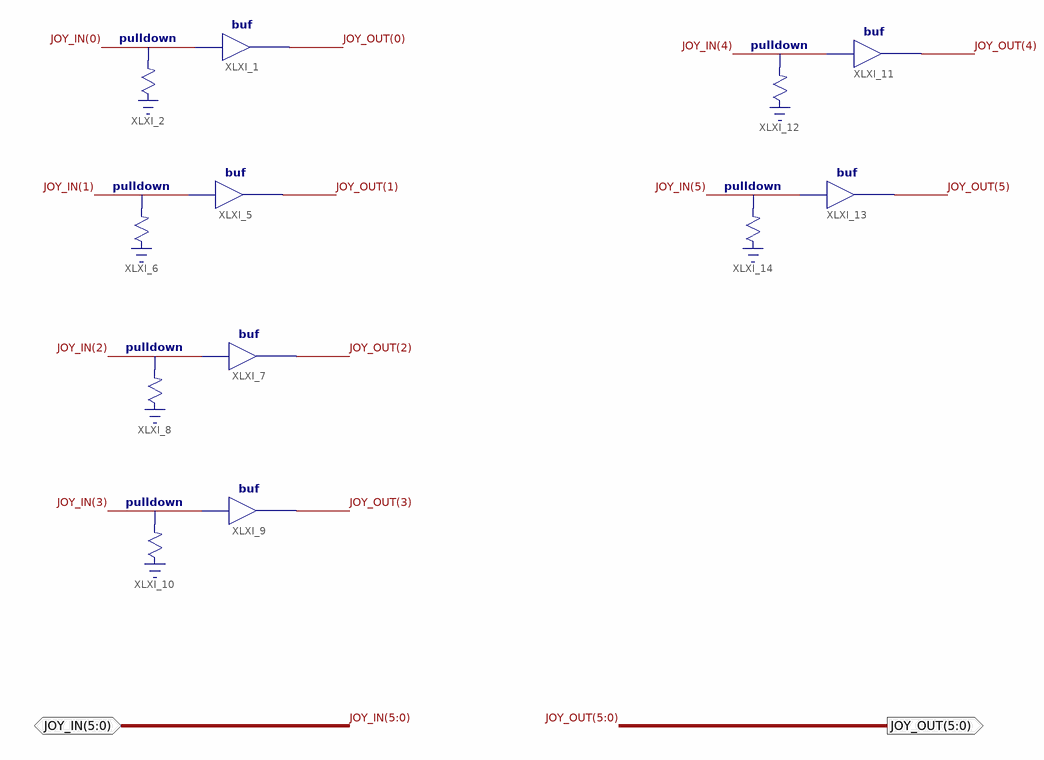
[diagram p0: schematic sheet 1]
// Xilinx ISE schematic joybuf.sch (spartan6) as structural Verilog: 12 symbols, 2 ports
module joybuf (
  inout  [5:0] JOY_IN,
  output [5:0] JOY_OUT
);

  buf XLXI_1 (JOY_OUT[0], JOY_IN[0]);
  \pulldown  XLXI_2 (.O(JOY_IN[0]));
  buf XLXI_5 (JOY_OUT[1], JOY_IN[1]);
  \pulldown  XLXI_6 (.O(JOY_IN[1]));
  buf XLXI_7 (JOY_OUT[2], JOY_IN[2]);
  \pulldown  XLXI_8 (.O(JOY_IN[2]));
  buf XLXI_9 (JOY_OUT[3], JOY_IN[3]);
  \pulldown  XLXI_10 (.O(JOY_IN[3]));
  buf XLXI_11 (JOY_OUT[4], JOY_IN[4]);
  \pulldown  XLXI_12 (.O(JOY_IN[4]));
  buf XLXI_13 (JOY_OUT[5], JOY_IN[5]);
  \pulldown  XLXI_14 (.O(JOY_IN[5]));
endmodule
